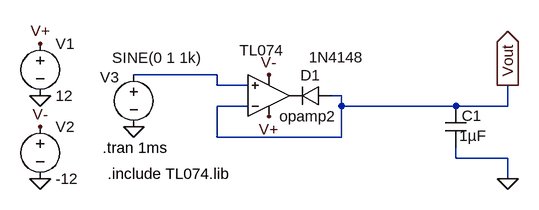
[diagram p0: schematic NegativePeakDetectorOpAmp.asc]
NegativePeakDetectorOpAmp.asc, the LTspice schematic file:
Version 4
SHEET 1 880 680
WIRE 128 112 0 112
WIRE 128 128 128 112
WIRE 176 128 128 128
WIRE 320 144 304 144
WIRE 176 160 128 160
WIRE 320 160 320 144
WIRE 496 160 320 160
WIRE 576 160 576 128
WIRE 576 160 496 160
WIRE 128 208 128 160
WIRE 320 208 320 160
WIRE 320 208 128 208
WIRE 496 240 496 224
WIRE 576 240 496 240
WIRE 576 272 576 240
FLAG 0 192 0
FLAG 576 272 0
FLAG -144 272 0
FLAG -144 144 0
FLAG -144 64 V+
FLAG -144 192 V-
FLAG 208 112 V-
FLAG 208 176 V+
FLAG 576 128 Vout
IOPIN 576 128 Out
SYMBOL diode 304 128 R90
WINDOW 0 0 32 VBottom 2
WINDOW 3 -59 -8 VTop 2
SYMATTR InstName D1
SYMATTR Value 1N4148
SYMBOL cap 480 160 R0
WINDOW 0 25 15 Left 2
WINDOW 3 21 46 Left 2
SYMATTR InstName C1
SYMATTR Value 1µF
SYMBOL voltage 0 96 R0
WINDOW 0 -52 20 Left 2
WINDOW 3 -33 -10 Left 2
WINDOW 123 0 0 Left 0
WINDOW 39 0 0 Left 0
SYMATTR InstName V3
SYMATTR Value SINE(0 1 1k)
SYMBOL voltage -144 48 R0
SYMATTR InstName V1
SYMATTR Value 12
SYMBOL voltage -144 176 R0
SYMATTR InstName V2
SYMATTR Value -12
SYMBOL OpAmps\\opamp2 208 208 M180
WINDOW 3 -45 134 Left 2
SYMATTR Value TL074
SYMATTR InstName opamp2
TEXT -48 224 Left 2 !.tran 1ms
TEXT -40 264 Left 2 !.include TL074.lib

The netlist it stands for:
* NegativePeakDetectorOpAmp.asc
D1 Vout P001 1N4148
C1 Vout 0 1µF
V3 N001 0 SINE(0 1 1k)
V1 V+ 0 12
V2 V- 0 -12
Xopamp2 N001 Vout V+ V- P001 TL074  ; pins In+ In- V+ V- OUT
.model D D
.lib standard.dio
.tran 1ms
.include TL074.lib
.backanno
.end